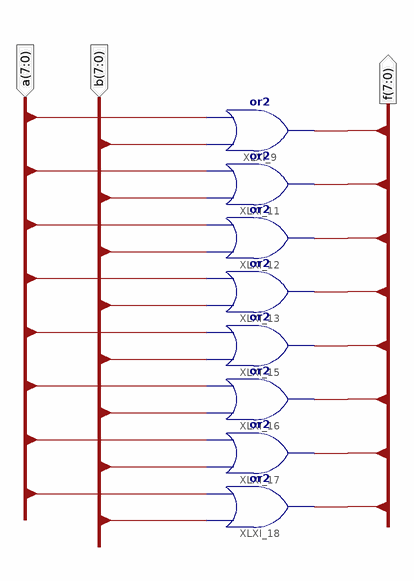
[diagram p0: schematic sheet 1]
// Xilinx ISE schematic or_8bit.sch (spartan3e) as structural Verilog: 8 symbols, 3 ports
module or_8bit (
  input  [7:0] a,
  input  [7:0] b,
  output [7:0] f
);

  or XLXI_9 (f[0], b[0], a[0]);
  or XLXI_11 (f[1], b[1], a[1]);
  or XLXI_12 (f[2], b[2], a[2]);
  or XLXI_13 (f[3], b[3], a[3]);
  or XLXI_15 (f[4], b[4], a[4]);
  or XLXI_16 (f[5], b[5], a[5]);
  or XLXI_17 (f[6], b[6], a[6]);
  or XLXI_18 (f[7], b[7], a[7]);
endmodule
